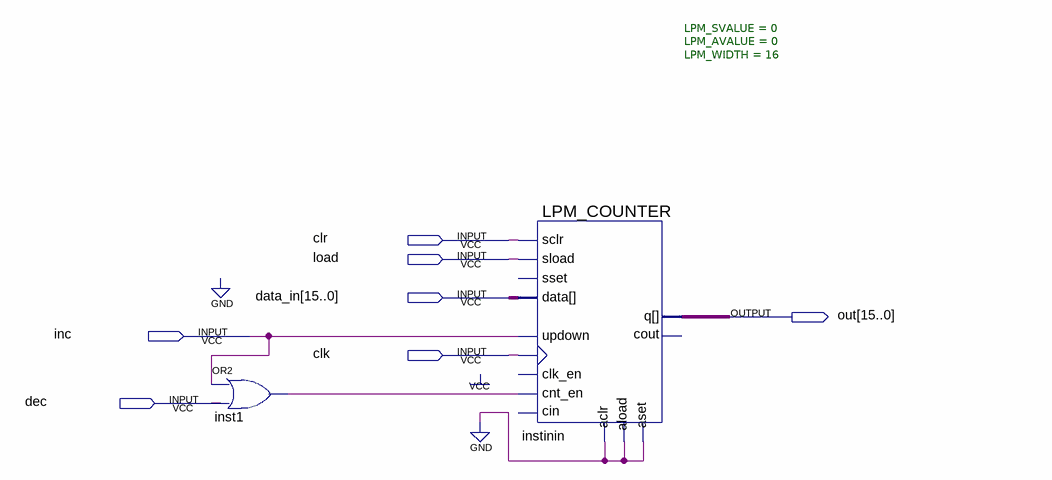
[diagram p0: schematic sheet]
// Quartus schematic register.bdf as structural Verilog: 2 symbols, 7 pins
module register (
  input  clr,
  input  load,
  input  [15:0] data_in,
  input  inc,
  input  clk,
  input  dec,
  output [15:0] out
);

  wire inst1_out;

  or inst1 (inst1_out, inc, dec);
  LPM_COUNTER #(.LPM_SVALUE(0), .LPM_AVALUE(0), .LPM_WIDTH(16)) instinin (
    .sload(load), .data(data_in), .clock(clk), .aload(1'b0), .aclr(1'b0), .aset(1'b0), .updown(inc),
    .cnt_en(inst1_out), .sclr(clr), .q(out));  // open: clk_en, cin, sset, cout
endmodule
